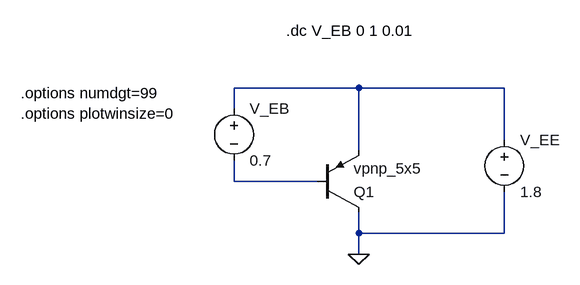
[diagram p0: schematic pnp_ic_veb.asc]
pnp_ic_veb.asc, the LTspice schematic file:
Version 4
SHEET 1 880 680
WIRE -16 48 -208 48
WIRE 208 48 -16 48
WIRE -208 80 -208 48
WIRE 208 128 208 48
WIRE -16 144 -16 48
WIRE -208 192 -208 160
WIRE -80 192 -208 192
WIRE -16 272 -16 240
WIRE 208 272 208 208
WIRE 208 272 -16 272
WIRE -16 304 -16 272
FLAG -16 304 0
SYMBOL pnp -80 240 M180
SYMATTR InstName Q1
SYMATTR Value vpnp_5x5
SYMBOL voltage -208 64 R0
WINDOW 123 0 0 Left 0
WINDOW 39 0 0 Left 0
SYMATTR InstName V_EB
SYMATTR Value 0.7
SYMBOL voltage 208 112 R0
WINDOW 123 0 0 Left 0
WINDOW 39 0 0 Left 0
SYMATTR InstName V_EE
SYMATTR Value 1.8
TEXT -128 -40 Left 2 !.dc V_EB 0 1 0.01
TEXT -536 56 Left 2 !.options numdgt=99\n.options plotwinsize=0

The netlist it stands for:
* pnp_ic_veb.asc
Q1 0 N002 N001 0 vpnp_5x5
V_EB N001 N002 0.7
V_EE N001 0 1.8
.model NPN NPN
.model PNP PNP
.lib standard.bjt
.dc V_EB 0 1 0.01
.options numdgt=99
.options plotwinsize=0
.backanno
.end